# EAGLE design placa2caras_CTO2_2 (EAGLE 7.6.0)
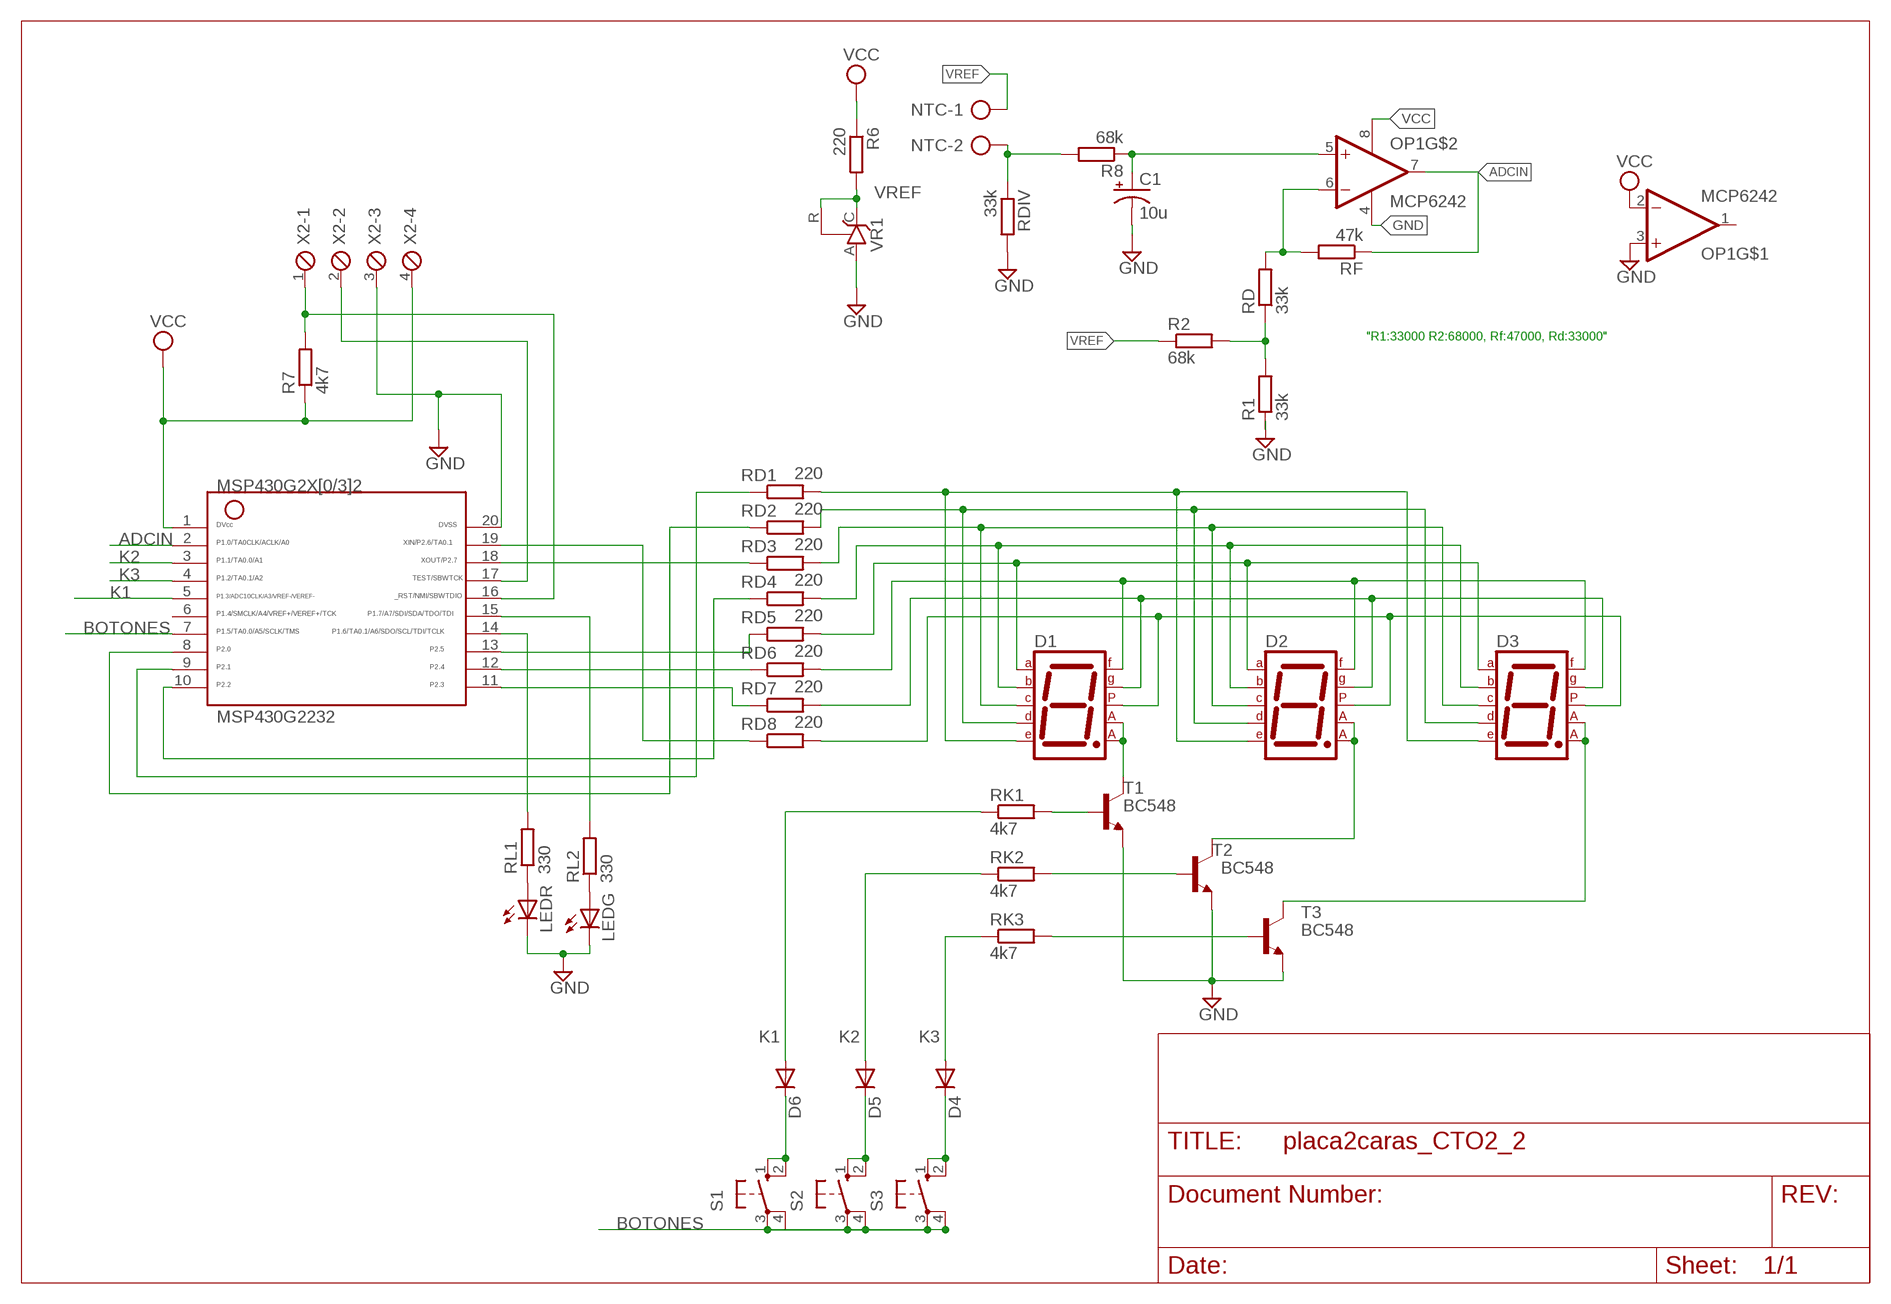
[diagram p0: schematic, sheet 1]

## Parts
C1  10u  CPOL-USE2,5-6E  [E2,5-6E]
D1  7SEG-CA  [7SEG-13]
D2  7SEG-CA  [7SEG-13]
D3  7SEG-CA  [7SEG-13]
D4  1N4148DO35-10  [DO35-10]
D5  1N4148DO35-10  [DO35-10]
D6  1N4148DO35-10  [DO35-10]
LEDG  LED5MM  [LED5MM]
LEDR  LED5MM  [LED5MM]
MSP430G2232  G2X[0/3]2---N20  [N20]
NTC  AK500/2  [AK500/2]
OP1  MCP6242  MCP6242CONPADGORDO  [DIL8_MOD]
R1  33k  R-EU_0207/10  [0207/10]
R2  68k  R-EU_0207/10  [0207/10]
R6  220  R-EU_0207/10  [0207/10]
R7  4k7  R-EU_0207/10  [0207/10]
R8  68k  R-EU_0207/10  [0207/10]
RD  33k  R-EU_0207/10  [0207/10]
RD1  220  R-EU_0207/10  [0207/10]
RD2  220  R-EU_0207/10  [0207/10]
RD3  220  R-EU_0207/10  [0207/10]
RD4  220  R-EU_0207/10  [0207/10]
RD5  220  R-EU_0207/10  [0207/10]
RD6  220  R-EU_0207/10  [0207/10]
RD7  220  R-EU_0207/10  [0207/10]
RD8  220  R-EU_0207/10  [0207/10]
RDIV  33k  R-EU_0207/10  [0207/10]
RF  47k  R-EU_0207/10  [0207/10]
RK1  4k7  R-EU_0207/10  [0207/10]
RK2  4k7  R-EU_0207/10  [0207/10]
RK3  4k7  R-EU_0207/10  [0207/10]
RL1  330  R-EU_0207/10  [0207/10]
RL2  330  R-EU_0207/10  [0207/10]
S1  10-XX  [B3F-10XX]
S2  10-XX  [B3F-10XX]
S3  10-XX  [B3F-10XX]
T1  BC548  [TO92-EBC]
T2  BC548  [TO92-EBC]
T3  BC548  [TO92-EBC]
VR1  TL431CLP  [TO92-CLP]
X2  MPT4  [4POL254]

## Nets
ADCIN: MSP430G2232.2 OP1.7(OUT) RF.1
BOTONES: MSP430G2232.7 S1.3(P) S1.4(P1) S2.3(P) S2.4(P1) S3.3(P) S3.4(P1)
GND: C1.- LEDG.K(C) LEDR.K(C) MSP430G2232.20 OP1.3(+IN) OP1.4(V-) R1.1 RDIV.2 T1.E T2.E T3.E VR1.A X2.3
K1: D6.A MSP430G2232.5 RK1.1
K2: D5.A MSP430G2232.3 RK2.1
K3: D4.A MSP430G2232.4 RK3.1
N$1: RK1.2 T1.B
N$2: RK2.2 T2.B
N$3: RK3.2 T3.B
N$4: D1.7(A) D2.7(A) D3.7(A) RD5.2
N$5: D1.3(CA1) D1.8(CA2) T1.C
N$6: D1.6(B) D2.6(B) D3.6(B) RD4.2
N$7: D2.3(CA1) D2.8(CA2) T2.C
N$8: D1.4(C) D2.4(C) D3.4(C) RD3.2
N$9: D3.3(CA1) D3.8(CA2) T3.C
N$10: D1.2(D) D2.2(D) D3.2(D) RD2.2
N$11: MSP430G2232.17 X2.2
N$12: D1.1(E) D2.1(E) D3.1(E) RD1.2
N$13: R1.2 R2.2 RD.1
N$14: D1.9(F) D2.9(F) D3.9(F) RD6.2
N$15: NTC.2 R8.2 RDIV.1
N$16: D1.10(G) D2.10(G) D3.10(G) RD7.2
N$17: C1.+ OP1.5(+IN) R8.1
N$18: D1.5(DP) D2.5(DP) D3.5(DP) RD8.2
N$19: OP1.6(-IN) RD.2 RF.2
N$20: MSP430G2232.16 R7.2 X2.1
N$21: MSP430G2232.19 RD8.1
N$22: MSP430G2232.18 RD3.1
N$23: MSP430G2232.13 RD5.1
N$24: MSP430G2232.12 RD6.1
N$25: MSP430G2232.11 RD7.1
N$26: MSP430G2232.10 RD4.1
N$27: MSP430G2232.9 RD1.1
N$28: MSP430G2232.8 RD2.1
N$29: D5.C S2.1(S) S2.2(S1)
N$30: D4.C S3.1(S) S3.2(S1)
N$31: D6.C S1.1(S) S1.2(S1)
N$32: MSP430G2232.15 RL2.2
N$33: LEDR.A RL1.1
N$34: MSP430G2232.14 RL1.2
N$35: LEDG.A RL2.1
VCC: MSP430G2232.1 OP1.2(-IN) OP1.8(V+) R6.1 R7.1 X2.4
VREF: NTC.1 R2.1 R6.2 VR1.C VR1.R
Unconnected: MSP430G2232.6 OP1.1(OUT)

## Notes on the sheet
- "R1:33000 R2:68000, Rf:47000, Rd:33000"

## Library data of the parts
C1 = rcl:CPOL-US: POLARIZED CAPACITOR, American symbol
D1-D3 = special:7SEG-CA: 7-segment DISPLAY single anode, 13 mm
D4-D6 = diode:1N4148: DIODE high speed (Philips)
LEDG LEDR = led:LED: LED OSRAM: - CHIPLED LG R971, LG N971, LY N971, LG Q971, LY Q971, LO R971, LY R971 LH N974, LH R974 LS Q976, LO Q976, LY Q976 LO Q996 - Hyper CHIPLED LW Q18S LB Q993, LB Q99A, LB R99A - SideLED LS A670, LO A670, LY A670, LG A670, LP A670 LB A673, LV A673, LT A673, LW A673 LH A674 LY A675 LS A676, LA A676, LO A676, LY A676, LW A676 LS A679, LY A679, LG A679 - Hyper Micro SIDELED® LS Y876, LA Y876, LO Y876, LY Y876 LT Y87S - SmartLED LW L88C, LW L88S LB L89C, LB L89S, LG L890 LS L89K, LO L89K, LY L89K LS L896, LA L896, LO L896, LY L896 - TOPLED LS T670, LO T670, LY T670, LG T670, LP T670 LSG T670, LSP T670, LSY T670, LOP T670, LYG T670 LG T671, LOG T671, LSG T671 LB T673, LV T673, LT T673, LW T673 LH T674 LS T676, LA T676, LO T676, LY T676, LB T676, LH T676, LSB T676, LW T676 LB T67C, LV T67C, LT T67C, LS T67K, LO T67K, LY T67K, LW E67C LS E67B, LA E67B, LO E67B, LY E67B, LB E67C, LV E67C, LT E67C LW T67C LS T679, LY T679, LG T679 LS T770, LO T770, LY T770, LG T770, LP T770 LB T773, LV T773, LT T773, LW T773 LH T774 LS E675, LA E675, LY E675, LS T675 LS T776, LA T776, LO T776, LY T776, LB T776 LHGB T686 LT T68C, LB T68C - Hyper Mini TOPLED® LB M676 - Mini TOPLED Santana® LG M470 LS M47K, LO M47K, LY M47K Source: http://www.osram.convergy.de LUXEON: - LUMILED® LXK2-PW12-R00, LXK2-PW12-S00, LXK2-PW14-U00, LXK2-PW14-V00 LXK2-PM12-R00, LXK2-PM12-S00, LXK2-PM14-U00 LXK2-PE12-Q00, LXK2-PE12-R00, LXK2-PE12-S00, LXK2-PE14-T00, LXK2-PE14-U00 LXK2-PB12-K00, LXK2-PB12-L00, LXK2-PB12-M00, LXK2-PB14-N00, LXK2-PB14-P00, LXK2-PB14-Q00 LXK2-PR12-L00, LXK2-PR12-M00, LXK2-PR14-Q00, LXK2-PR14-R00 LXK2-PD12-Q00, LXK2-PD12-R00, LXK2-PD12-S00 LXK2-PH12-R00, LXK2-PH12-S00 LXK2-PL12-P00, LXK2-PL12-Q00, LXK2-PL12-R00 Source: www.luxeon.com KINGBRIGHT: KA-3528ASYC Source: www.kingbright.com
MSP430G2232 = TI_MSP430_v16:G2X[0/3]2---N20: MSP430G2X[0/3]2 MSP430G2x32, MSP430G2x02 PDIP (N) 20 Pin Package http://focus.ti.com/docs/prod/folders/print/msp430g2432.html
NTC = con-ptr500:AK500/2: CONNECTOR; OC_FARNELL: unknown; OC_NEWARK: unknown
OP1 = linear:MCP6242: Opamp de Microchip. Rail to rail, 3V
R1 R2 R6-R8 RD RD1-RD8 RDIV RF RK1-RK3 = resistor_mod2:R-EU_: RESISTOR, European symbol
RL1 RL2 = resistor_mod:R-EU_: RESISTOR, European symbol
S1-S3 = switch-omron:10-XX: OMRON SWITCH; MPN: B3F-1000; OC_FARNELL: 176432; OC_NEWARK: 36M3542
T1-T3 = transistor-npn:BC548*: NPN Transistor
VR1 = v-reg:TL431CLP: VOLTAGE REGULATOR
X2 = con-phoenix-254:MPT4: PHOENIX CONNECTOR; OC_FARNELL: unknown; OC_NEWARK: unknown

## Board
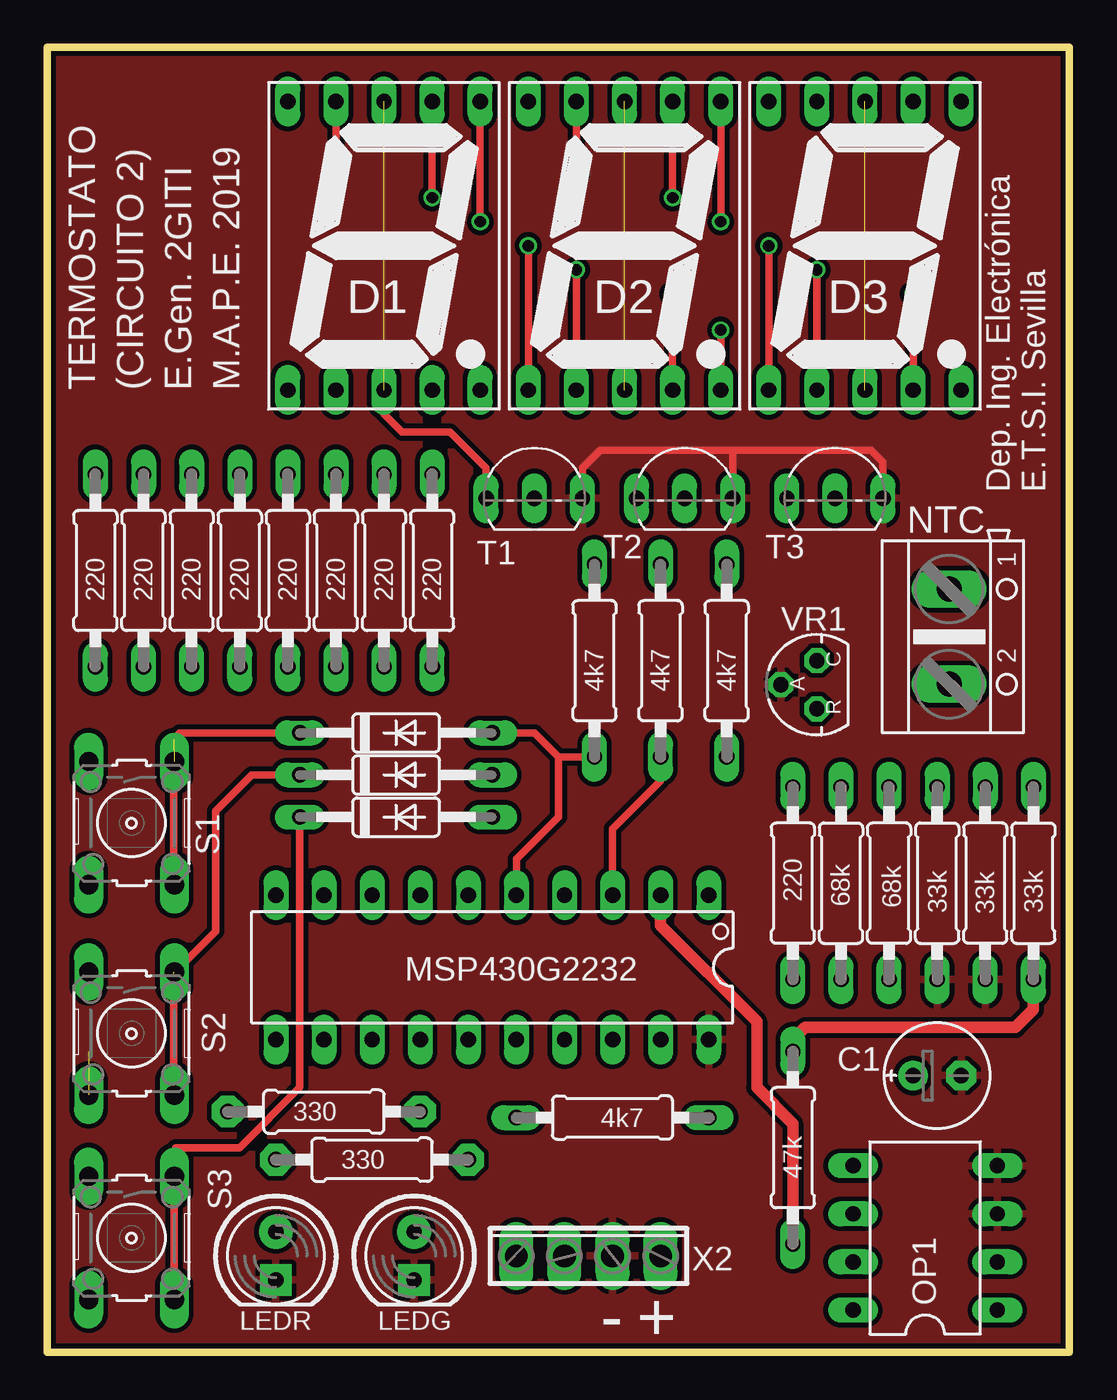
[diagram p1: board, top side]
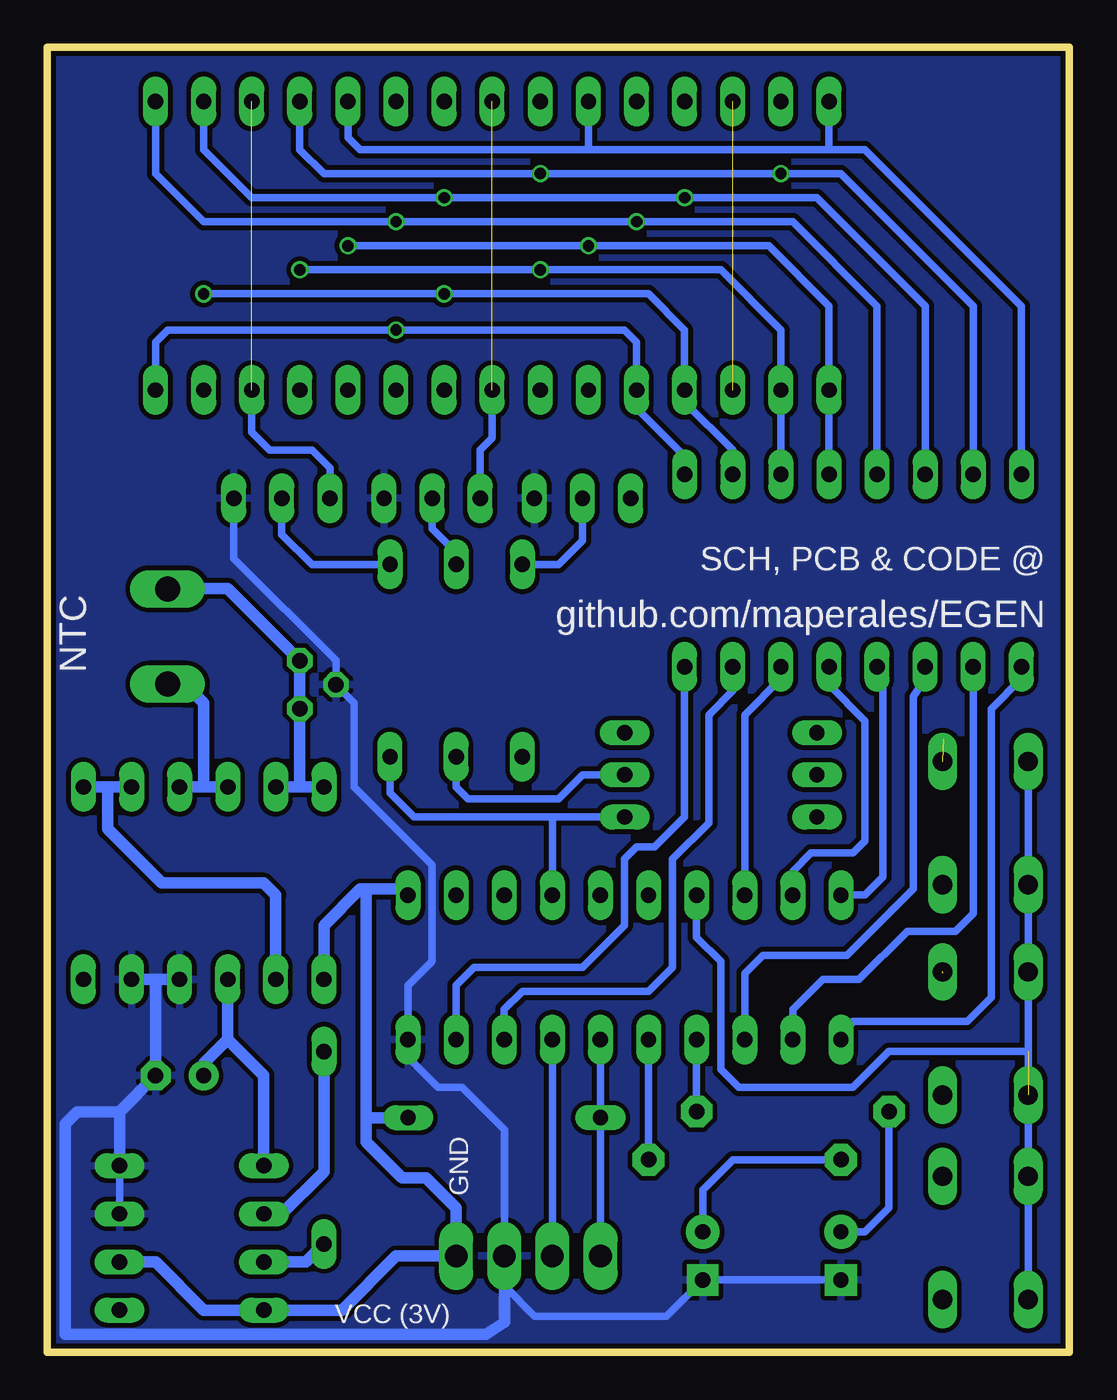
[diagram p2: board, bottom side, seen from below]

Size 53.98 x 68.9 mm. Coordinates in mm from the lower left corner, seen from the top.
Outline: 0,68.9 53.98,68.9 53.98,0 0,0 0,68.9
Copper layers (1*16): Top 0.035mm / dielectric 1.5mm / Bottom 0.035mm
Design rules "SeeedStudio_2layer_DRU_no_angle_20140221": minimum track width 6mil, minimum drill 12mil, track to track 6mil, track to pad 6mil, pad to pad 6mil, via to via 6mil, smd to smd 0mil, copper to edge 10mil, drill to drill 10mil, minimum pad ring 10mil, minimum via ring 6mil, stop-mask expansion 2mil, vias tented up to drill 100mil, thermal gap 10mil

### Footprints (pad centres in the part's own frame; a part is rotated, then mirrored left to right if it is on the bottom)
E2,5-6E = drill 0.813 pad 1.575: + -1.27,0 | drill 0.813 pad 1.575 octagon: - 1.27,0
7SEG-13 = drill 0.813 long: 1 -5.08,-7.62; 2 -2.54,-7.62; 3 0,-7.62; 4 2.54,-7.62; 5 5.08,-7.62; 6 5.08,7.62; 7 2.54,7.62; 8 0,7.62; 9 -2.54,7.62; 10 -5.08,7.62
DO35-10 = drill 0.813 long: A 5.08,0; C -5.08,0
LED5MM = drill 0.8 pad 1.778: A -1.27,0 | drill 0.8 pad 1.676 square: K 1.27,0
N20 = drill 0.813 long: 1 -11.435,-3.81; 2 -8.895,-3.81; 3 -6.355,-3.81; 4 -3.815,-3.81; 5 -1.275,-3.81; 6 1.265,-3.81; 7 3.805,-3.81; 8 6.345,-3.81; 9 8.885,-3.81; 10 11.425,-3.81; 11 11.425,3.81; 12 8.885,3.81; 13 6.345,3.81; 14 3.805,3.81; 15 1.265,3.81; 16 -1.275,3.81; 17 -3.815,3.81; 18 -6.355,3.81; 19 -8.895,3.81; 20 -11.435,3.81
AK500/2 = drill 1.321 long: 1 -2.515,0; 2 2.515,0
DIL8_MOD = drill 0.813 pad 1.27 long: 1 -6.35,-3.81; 2 -3.81,-3.81; 3 -1.27,-3.81; 4 1.27,-3.81; 5 1.27,3.81; 6 -1.27,3.81; 7 -3.81,3.81; 8 -6.35,3.81
0207/10 = drill 0.813 long: 1 -5.08,0; 2 5.08,0
0207/10' = drill 0.813 pad 1.676 octagon: 1 -5.08,0; 2 5.08,0
B3F-10XX = drill 1.016 long: 1 -3.251,2.261; 2 3.251,2.261; 3 -3.251,-2.261; 4 3.251,-2.261
TO92-EBC = drill 0.813 long: B 0,-1.27; C -2.54,-1.27; E 2.54,-1.27
TO92-CLP = drill 0.813 octagon: A 0,1.905; C 1.27,0; R -1.27,0
4POL254 = drill 1.2 long: 1 -3.81,0; 2 -1.27,0; 3 1.27,0; 4 3.81,0

### Placement (x,y rotation side)
C1  46.99,14.6 0 top
D1  17.78,58.42 0 top
D2  30.48,58.42 0 top
D3  43.18,58.42 0 top
D4  18.41,28.26 0 top
D5  18.41,30.48 0 top
D6  18.41,32.7 0 top
LEDG  19.37,5.08 270 top
LEDR  12.06,5.08 270 top
MSP430G2232  23.49,20.32 180 top
NTC  47.62,37.78 270 top
OP1  46.36,8.57 90 top
R1  49.53,24.77 90 top
R2  41.91,24.77 270 top
R6  39.37,24.77 90 top
R7  29.84,12.38 180 top
R8  44.45,24.77 90 top
RD  52.07,24.77 270 top
RD1  12.7,41.27 90 top
RD2  15.24,41.27 90 top
RD3  17.78,41.27 90 top
RD4  10.16,41.27 90 top
RD5  7.62,41.27 90 top
RD6  5.08,41.27 90 top
RD7  2.54,41.27 90 top
RD8  20.32,41.27 90 top
RDIV  46.99,24.77 270 top
RF  39.37,10.79 90 top
RK1  28.89,36.51 90 top
RK2  32.39,36.51 90 top
RK3  35.88,36.51 90 top
RL1  330  [0207/10']  14.6,12.7 0 top
RL2  330  [0207/10']  17.15,10.16 0 top
S1  4.45,27.94 270 top
S2  4.45,16.83 270 top
S3  4.45,6.03 270 top
T1  25.72,46.35 0 top
T2  33.66,46.35 0 top
T3  41.59,46.35 0 top
VR1  40.64,35.24 90 top
X2  28.58,5.08 0 top

### Tracks (layer width: path | path; a pad name or v marks a point on that pad's centre or on a via)
ADCIN
  Top 0.61: MSP430G2232.2 32.39,22.54 37.47,17.46 37.47,13.97 39.37,12.06 RF.1
  Bottom 0.61: OP1.7 40.32,4.76 RF.1
BOTONES  (1 unrouted)
  Bottom 0.406: MSP430G2232.7 19.69,21.91 18.41,20.64 18.41,14.92 17.46,13.97 11.43,13.97 9.53,15.87 2.18,15.87 | S3.4 S3.3 2.18,15.87 | 2.18,15.87 S2.3 S1.4 S1.3
GND
  Top 0.406: T1.E 28.26,46.67 29.21,47.62 36.2,47.62 | 36.2,47.62 43.5,47.62 44.13,46.99 T3.E | T2.E 36.2,47.62
  Bottom 0.406: LEDR.K LEDG.K 21.27,1.9 28.26,1.9 29.84,3.49 X2.3 29.84,11.75 32.07,13.97 33.34,13.97 34.93,15.56 34.93,16.2 MSP430G2232.20 34.93,19.37 33.66,20.64 33.66,25.72 37.78,29.85 37.78,34.29 VR1.A 38.73,36.51 44.13,41.91 T3.E | OP1.3 OP1.4
  Bottom 0.61: OP1.4 50.16,12.7 | RDIV.2 48.26,19.69 | R1.1 48.26,19.69 | 48.26,19.69 C1.- 50.16,12.7 | 50.16,12.7 52.39,12.7 53.02,12.06 53.02,0.95 30.8,0.95 29.84,1.59 X2.3
  pour Top (isolate 0.254): -0.32,69.22 54.29,69.22 54.29,-1.27 -0.32,-0.95
  pour Bottom (isolate 0.254): -0.32,69.53 53.98,69.22 54.29,-0.64 -0.32,-0.64
K1
  Top 0.406: MSP430G2232.5 24.77,26.04 26.99,28.26 26.99,31.43 | 26.99,31.43 27.31,31.43 RK1.1 | 26.99,31.43 25.72,32.7 D6.A
K2
  Top 0.406: MSP430G2232.3 29.85,27.63 32.39,30.16 RK2.1
  Bottom 0.406: D5.A 25.72,30.48 26.99,29.21 31.76,29.21 32.39,29.85 RK2.1
K3
  Bottom 0.406: MSP430G2232.4 27.31,28.25 D4.A 34.61,28.26 35.88,29.53 RK3.1
N$1
  Bottom 0.406: RK1.2 26.99,41.59 25.72,42.86 T1.B
N$2
  Bottom 0.406: RK2.2 32.39,42.23 33.66,43.5 T2.B
N$3
  Bottom 0.406: RK3.2 40.01,41.59 41.59,43.18 T3.B
N$4  (via drill 0.6)
  Top 0.406: D1.7 v20.32,60.96 | D2.7 v33.02,60.96
  Bottom 0.406: D3.7 45.72,63.5 43.18,60.96 v33.02,60.96 v20.32,60.96 13.33,60.96 7.62,55.24 RD5.2
N$5  (1 unrouted)
  Top 0.406: T1.C 23.18,46.67 21.27,48.58 18.73,48.58 17.78,49.53 D1.3
N$6  (via drill 0.6)
  Top 0.406: D1.6 v22.86,59.69 | D2.6 v35.56,59.69
  Bottom 0.406: D3.6 48.26,62.23 45.72,59.69 v35.56,59.69 v22.86,59.69 14.6,59.69 10.16,55.24 RD4.2
N$7  (1 unrouted)
  Bottom 0.406: T2.C 31.12,47.62 30.48,48.26 D2.3
N$8  (via drill 0.6)
  Top 0.406: D2.4 v33.02,55.88 | D3.4 v45.72,55.88
  Bottom 0.406: v45.72,55.88 v33.02,55.88 22.23,55.88 20.32,53.97 D1.4 20.32,50.16 17.78,47.62 RD3.2
N$9  (1 unrouted)
  Bottom 0.406: T3.C 39.05,46.67 40.01,47.62 42.23,47.62 43.18,48.58 D3.3
N$10  (via drill 0.6)
  Top 0.406: D2.2 v27.94,57.15 | D3.2 v40.64,57.15
  Bottom 0.406: v40.64,57.15 v27.94,57.15 18.41,57.15 15.24,53.97 D1.2 RD2.2
N$11
  Bottom 0.406: MSP430G2232.17 X2.2
N$12  (via drill 0.6)
  Top 0.406: D2.1 v25.4,58.42 | D3.1 v38.1,58.42
  Bottom 0.406: v38.1,58.42 v25.4,58.42 15.87,58.42 12.7,55.24 D1.1 RD1.2
N$13
  Bottom 0.61: RD.1 50.8,29.85 | 50.8,29.85 R1.2 | R2.2 41.91,24.13 42.55,24.77 47.94,24.77 50.8,27.62 50.8,29.85
N$14  (via drill 0.6)
  Top 0.406: D1.9 v15.24,62.23 | D2.9 v27.94,62.23
  Bottom 0.406: D3.9 40.64,63.5 39.37,62.23 v27.94,62.23 v15.24,62.23 12.06,62.23 5.08,55.24 RD6.2
N$15
  Bottom 0.61: R8.2 45.72,29.85 | 45.72,29.85 RDIV.1 | NTC.2 46.7,35.27 45.72,34.29 45.72,29.85
N$16
  Bottom 0.406: 12.7,63.5 10.79,63.5 2.54,55.24 RD7.2 | D1.10 12.7,63.5 | 12.7,63.5 25.4,63.5 | 25.4,63.5 D2.10 | D3.10 38.1,64.13 37.47,63.5 25.4,63.5
N$17
  Bottom 0.61: R8.1 44.45,16.51 | 44.45,16.51 42.55,14.6 OP1.5 | C1.+ 45.72,15.24 44.45,16.51
N$18  (via drill 0.6)
  Top 0.406: D2.5 v35.56,53.97
  Bottom 0.406: D3.5 48.26,53.34 47.62,53.97 v35.56,53.97 23.49,53.97 22.86,53.34 D1.5 22.86,49.85 20.32,47.31 RD8.2
N$19
  Top 0.61: RF.2 39.37,16.51 40.01,17.14 51.12,17.14 52.07,18.1 RD.2
  Bottom 0.61: OP1.6 41.59,7.3 39.37,9.53 RF.2
N$20
  Bottom 0.406: X2.1 R7.2 24.77,12.71 MSP430G2232.16
N$21
  Bottom 0.406: RD8.1 20.32,28.26 21.91,26.67 22.86,26.67 23.49,26.04 23.49,22.54 25.72,20.32 31.43,20.32 32.39,19.37 MSP430G2232.19
N$22
  Bottom 0.406: RD3.1 17.78,34.92 19.05,33.66 19.05,27.94 20.95,26.04 20.95,20.32 22.23,19.05 28.89,19.05 29.85,18.09 MSP430G2232.18
N$23
  Bottom 0.406: MSP430G2232.13 17.15,17.47 17.15,20 16.19,20.96 11.75,20.96 8.26,24.45 8.26,34.61 7.62,35.56 RD5.1
N$24
  Bottom 0.406: RD6.1 5.08,23.18 6.03,22.23 8.57,22.23 11.11,19.69 13.02,19.69 14.6,18.1 MSP430G2232.12
N$25
  Bottom 0.406: RD7.1 2.54,35.56 4.13,33.97 4.13,18.73 5.4,17.46 11.43,17.46 MSP430G2232.11
N$26
  Bottom 0.406: RD4.1 9.84,35.56 9.84,25.08 10.79,24.13 MSP430G2232.10
N$27
  Bottom 0.406: MSP430G2232.9 14.61,25.39 13.65,26.35 11.43,26.35 10.79,26.99 10.79,33.34 12.7,35.24 RD1.1
N$28
  Bottom 0.406: RD2.1 15.24,35.56 17.15,33.66 17.15,24.45 MSP430G2232.8
N$29  (1 unrouted)
  Top 0.406: D5.C 10.79,30.48 8.89,28.57 8.89,22.23 6.67,20 6.67,15.44 S2.2
N$30
  Top 0.406: D4.C 13.33,13.97 10.16,10.79 6.78,10.79 S3.1 S3.2
N$31  (1 unrouted)
  Top 0.406: D6.C 6.98,32.7 6.67,32.38 6.67,26.24 S1.2
N$32
  Bottom 0.406: MSP430G2232.15 RL2.2
N$33
  Bottom 0.406: RL1.1 9.53,7.62 10.79,6.35 LEDR.A
N$34
  Bottom 0.406: MSP430G2232.14 RL1.2
N$35
  Bottom 0.406: RL2.1 17.78,10.16 19.37,8.57 LEDG.A
VCC
  Bottom 0.61: OP1.2 48.26,4.76 45.72,2.22 OP1.8 38.42,2.22 35.56,5.08 X2.4 32.39,7.62 33.97,9.21 35.24,9.21 37.15,11.11 37.15,12.38 | R6.1 39.37,22.54 37.47,24.45 37.15,24.45 | 37.15,24.45 35.25,24.45 MSP430G2232.1 | 37.15,12.38 37.15,24.45 | R7.1 37.15,12.38
VREF
  Bottom 0.406: VR1.C 40.64,36.83 40.96,36.83
  Bottom 0.61: VR1.C VR1.R 40.64,29.85 | 40.96,36.83 44.45,40.32 46.97,40.32 NTC.1 | R6.2 40.64,29.85 | 40.64,29.85 R2.1

### Text on the board
tNames: TERMOSTATO | (CIRCUITO 2) | E.Gen. 2GITI | M.A.P.E. 2019 | Dep. Ing. Electrónica / E.T.S.I. Sevilla | - | +
bNames: SCH, PCB & CODE @ | NTC | github.com/maperales/EGEN | GND | VCC (3V)